# EAGLE design STM32F446RC_single layer (EAGLE 9.2.0)
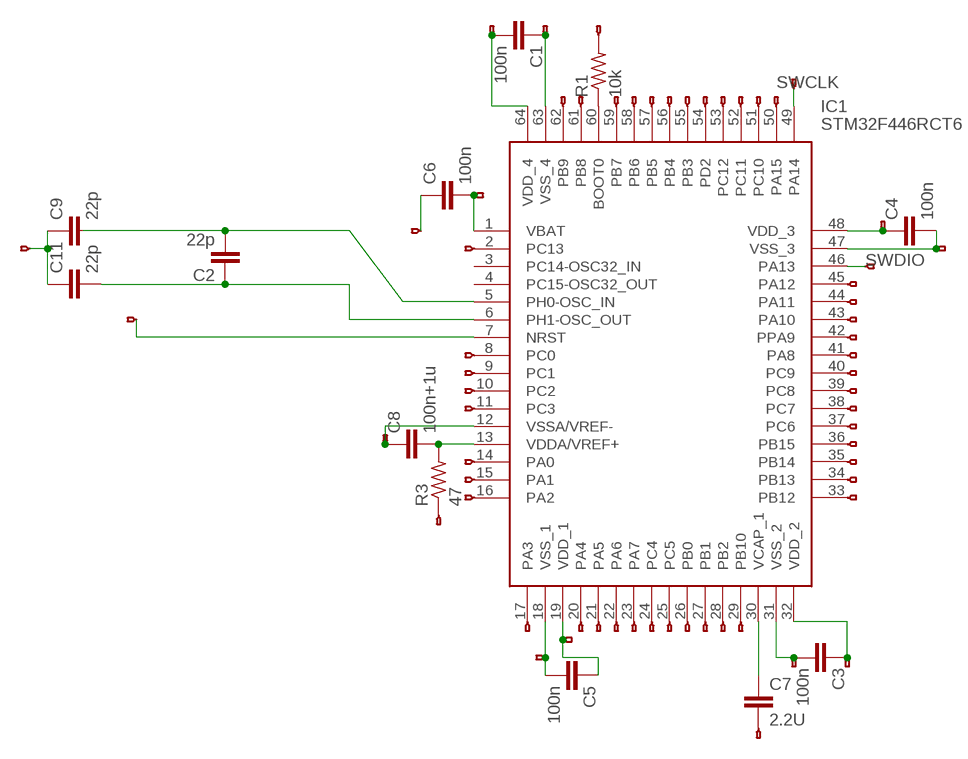
[diagram p0: schematic, sheet 1]

## Parts
C1  100n  C2,5-3  [C2.5-3]
C2  22p  C2,5-3  [C2.5-3]
C3  100n  C2,5-3  [C2.5-3]
C4  100n  C2,5-3  [C2.5-3]
C5  100n  C2,5-3  [C2.5-3]
C6  100n  C2,5-3  [C2.5-3]
C7  2.2U  C2,5-3  [C2.5-3]
C8  100n+1u  C2,5-3  [C2.5-3]
C9  22p  C2,5-3  [C2.5-3]
C11  22p  C2,5-3  [C2.5-3]
IC1  STM32F446RCT6  [QFP50P1200X1200X160-64N]
JP1  HEADERHOLE-HEADERHOLE  [1X1-HEADER-HOLE]
JP2  HEADERHOLE-HEADERHOLE  [1X1-HEADER-HOLE]
JP3  HEADERHOLE-HEADERHOLE  [1X1-HEADER-HOLE]
JP4  HEADERHOLE-HEADERHOLE  [1X1-HEADER-HOLE]
JP5  HEADERHOLE-HEADERHOLE  [1X1-HEADER-HOLE]
JP6  HEADERHOLE-HEADERHOLE  [1X1-HEADER-HOLE]
JP7  HEADERHOLE-HEADERHOLE  [1X1-HEADER-HOLE]
JP9  HEADERHOLE-HEADERHOLE  [1X1-HEADER-HOLE]
JP10  HEADERHOLE-HEADERHOLE  [1X1-HEADER-HOLE]
JP11  HEADERHOLE-HEADERHOLE  [1X1-HEADER-HOLE]
JP12  HEADERHOLE-HEADERHOLE  [1X1-HEADER-HOLE]
JP13  HEADERHOLE-HEADERHOLE  [1X1-HEADER-HOLE]
JP14  HEADERHOLE-HEADERHOLE  [1X1-HEADER-HOLE]
JP15  HEADERHOLE-HEADERHOLE  [1X1-HEADER-HOLE]
JP16  HEADERHOLE-HEADERHOLE  [1X1-HEADER-HOLE]
JP17  HEADERHOLE-HEADERHOLE  [1X1-HEADER-HOLE]
JP18  HEADERHOLE-HEADERHOLE  [1X1-HEADER-HOLE]
JP19  HEADERHOLE-HEADERHOLE  [1X1-HEADER-HOLE]
JP20  HEADERHOLE-HEADERHOLE  [1X1-HEADER-HOLE]
JP21  HEADERHOLE-HEADERHOLE  [1X1-HEADER-HOLE]
JP22  HEADERHOLE-HEADERHOLE  [1X1-HEADER-HOLE]
JP23  HEADERHOLE-HEADERHOLE  [1X1-HEADER-HOLE]
JP24  HEADERHOLE-HEADERHOLE  [1X1-HEADER-HOLE]
JP25  HEADERHOLE-HEADERHOLE  [1X1-HEADER-HOLE]
JP26  HEADERHOLE-HEADERHOLE  [1X1-HEADER-HOLE]
JP27  HEADERHOLE-HEADERHOLE  [1X1-HEADER-HOLE]
JP28  HEADERHOLE-HEADERHOLE  [1X1-HEADER-HOLE]
JP29  HEADERHOLE-HEADERHOLE  [1X1-HEADER-HOLE]
JP30  HEADERHOLE-HEADERHOLE  [1X1-HEADER-HOLE]
JP31  HEADERHOLE-HEADERHOLE  [1X1-HEADER-HOLE]
JP32  HEADERHOLE-HEADERHOLE  [1X1-HEADER-HOLE]
JP33  HEADERHOLE-HEADERHOLE  [1X1-HEADER-HOLE]
JP34  HEADERHOLE-HEADERHOLE  [1X1-HEADER-HOLE]
JP35  HEADERHOLE-HEADERHOLE  [1X1-HEADER-HOLE]
JP36  HEADERHOLE-HEADERHOLE  [1X1-HEADER-HOLE]
JP37  HEADERHOLE-HEADERHOLE  [1X1-HEADER-HOLE]
JP38  HEADERHOLE-HEADERHOLE  [1X1-HEADER-HOLE]
JP39  HEADERHOLE-HEADERHOLE  [1X1-HEADER-HOLE]
JP40  HEADERHOLE-HEADERHOLE  [1X1-HEADER-HOLE]
JP41  HEADERHOLE-HEADERHOLE  [1X1-HEADER-HOLE]
JP42  HEADERHOLE-HEADERHOLE  [1X1-HEADER-HOLE]
JP43  HEADERHOLE-HEADERHOLE  [1X1-HEADER-HOLE]
JP44  HEADERHOLE-HEADERHOLE  [1X1-HEADER-HOLE]
JP45  HEADERHOLE-HEADERHOLE  [1X1-HEADER-HOLE]
JP46  HEADERHOLE-HEADERHOLE  [1X1-HEADER-HOLE]
JP47  HEADERHOLE-HEADERHOLE  [1X1-HEADER-HOLE]
JP48  HEADERHOLE-HEADERHOLE  [1X1-HEADER-HOLE]
JP49  HEADERHOLE-HEADERHOLE  [1X1-HEADER-HOLE]
JP50  HEADERHOLE-HEADERHOLE  [1X1-HEADER-HOLE]
JP51  HEADERHOLE-HEADERHOLE  [1X1-HEADER-HOLE]
JP52  HEADERHOLE-HEADERHOLE  [1X1-HEADER-HOLE]
JP53  HEADERHOLE-HEADERHOLE  [1X1-HEADER-HOLE]
JP54  HEADERHOLE-HEADERHOLE  [1X1-HEADER-HOLE]
JP55  HEADERHOLE-HEADERHOLE  [1X1-HEADER-HOLE]
JP56  HEADERHOLE-HEADERHOLE  [1X1-HEADER-HOLE]
JP57  HEADERHOLE-HEADERHOLE  [1X1-HEADER-HOLE]
JP58  HEADERHOLE-HEADERHOLE  [1X1-HEADER-HOLE]
JP59  HEADERHOLE-HEADERHOLE  [1X1-HEADER-HOLE]
JP61  HEADERHOLE-HEADERHOLE  [1X1-HEADER-HOLE]
JP62  HEADERHOLE-HEADERHOLE  [1X1-HEADER-HOLE]
JP63  HEADERHOLE-HEADERHOLE  [1X1-HEADER-HOLE]
JP65  HEADERHOLE-HEADERHOLE  [1X1-HEADER-HOLE]
R1  10k  R-US_0204/2V  [0204V]
R3  47  R-US_0204/2V  [0204V]

## Nets
N$1: C3.2 IC1.31(VSS_2) JP50.1
N$2: C8.2 IC1.13(VDDA/VREF+) R3.2
N$3: IC1.7(NRST) JP63.1
N$4: C5.2 IC1.18(VSS_1) JP20.1
N$5: IC1.60(BOOT0) R1.1
N$6: C1.2 IC1.64(VDD_4) JP58.1
N$7: C2.1 C11.2 IC1.6(PH1-OSC_OUT)
N$8: C1.1 IC1.63(VSS_4) JP57.1
N$9: IC1.59(PB7) JP43.1
N$10: IC1.58(PB6) JP42.1
N$11: IC1.24(PC4) JP12.1
N$12: IC1.25(PC5) JP23.1
N$13: IC1.26(PB0) JP22.1
N$14: IC1.27(PB1) JP17.1
N$15: IC1.28(PB2) JP16.1
N$16: IC1.29(PB10) JP14.1
N$17: IC1.23(PA7) JP11.1
N$18: IC1.22(PA6) JP9.1
N$19: IC1.21(PA5) JP19.1
N$20: IC1.17(PA3) JP24.1
N$21: IC1.33(PB12) JP18.1
N$22: IC1.34(PB13) JP13.1
N$23: IC1.35(PB14) JP6.1
N$24: IC1.36(PB15) JP10.1
N$25: IC1.37(PC6) JP1.1
N$26: IC1.16(PA2) JP36.1
N$27: IC1.15(PA1) JP35.1
N$28: IC1.14(PA0) JP34.1
N$29: IC1.11(PC3) JP4.1
N$30: IC1.10(PC2) JP3.1
N$31: IC1.9(PC1) JP27.1
N$32: IC1.8(PC0) JP29.1
N$33: IC1.2(PC13) JP26.1
N$34: IC1.38(PC7) JP15.1
N$35: IC1.39(PC8) JP2.1
N$36: IC1.40(PC9) JP30.1
N$37: IC1.41(PA8) JP28.1
N$38: IC1.42(PPA9) JP31.1
N$39: IC1.43(PA10) JP33.1
N$40: IC1.44(PA11) JP32.1
N$41: IC1.45(PA12) JP25.1
N$42: IC1.57(PB5) JP41.1
N$43: IC1.56(PB4) JP40.1
N$44: IC1.55(PB3) JP44.1
N$45: IC1.54(PD2) JP38.1
N$46: IC1.53(PC12) JP39.1
N$47: IC1.52(PC11) JP5.1
N$48: IC1.51(PC10) JP37.1
N$49: IC1.50(PA15) JP45.1
N$50: IC1.61(PB8) JP46.1
N$51: IC1.62(PB9) JP47.1
N$52: IC1.20(PA4) JP21.1
N$53: C2.2 IC1.5(PH0-OSC_IN)
N$54: C7.2 JP49.1
N$55: C3.1 IC1.32(VDD_2) JP51.1
N$56: C4.2 IC1.47(VSS_3) JP52.1
N$57: JP56.1 R1.2
N$58: C6.2 IC1.1(VBAT) JP7.1
N$59: C8.1 IC1.12(VSSA/VREF-) JP62.1
N$60: JP61.1 R3.1
N$63: C9.1 C11.1 JP65.1
N$64: C5.1 IC1.19(VDD_1) JP48.1
N$66: C7.1 IC1.30(VCAP_1)
N$67: C6.1 JP59.1
N$89: C4.1 IC1.48(VDD_3) JP53.1
SWCLK: IC1.49(PA14) JP55.1
SWDIO: IC1.46(PA13) JP54.1
Unconnected: C9.2 IC1.3(PC14-OSC32_IN) IC1.4(PC15-OSC32_OUT)

## Library data of the parts
C1-C9 C11 = capacitor-wima:C: CAPACITOR naming: grid - package width
IC1 = STM32F446RCT6:STM32F446RCT6: STMICROELECTRONICS - STM32F446RCT6 - MCU, 32BIT, CORTEX-M4, 180MHZ, LQFP-64 Source: Datasheet <https://componentsearchengine.com/Datasheets/1/STM32F446RCT6.pdf>; DESCRIPTION: STMICROELECTRONICS - STM32F446RCT6 - MCU, 32BIT, CORTEX-M4, 180MHZ, LQFP-64; HEIGHT: 1.6mm; MANUFACTURER_NAME: STMicroelectronics; MANUFACTURER_PART_NUMBER: STM32F446RCT6; MOUSER_PART_NUMBER: 511-STM32F446RCT6; MOUSER_PRICE-STOCK: https://www.mouser.com/Search/Refine.aspx?Keyword=511-STM32F446RCT6
JP1-JP7 JP9-JP59 JP61-JP63 JP65 = F405Pill:HEADERHOLE
R1 R3 = rcl:R-US_: RESISTOR, American symbol; SPICEPREFIX: R

## Board
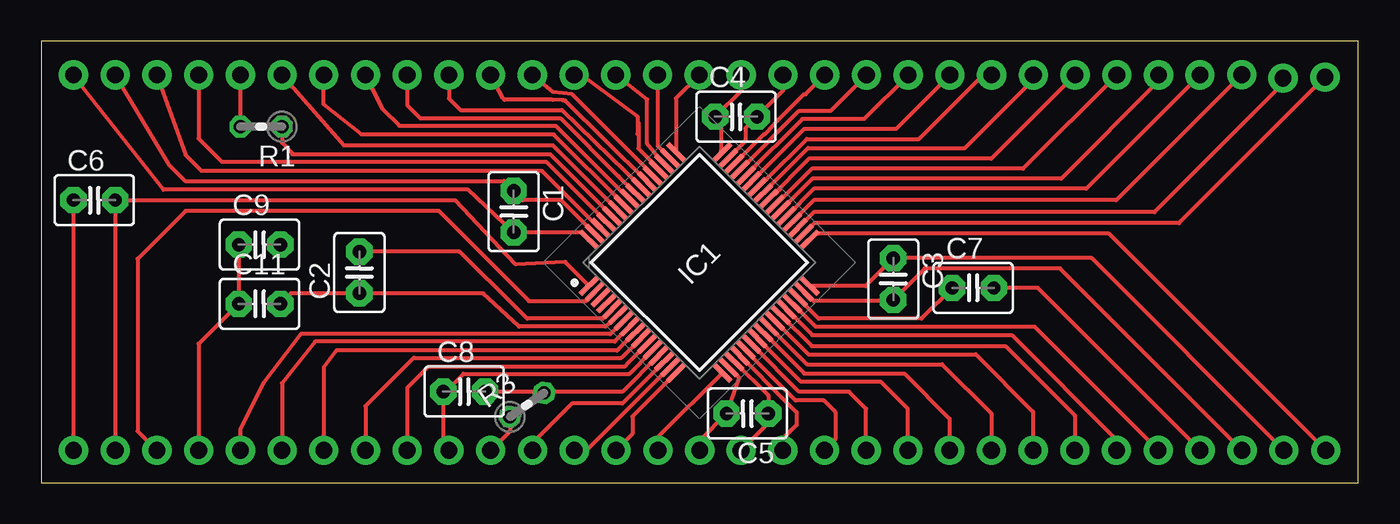
[diagram p1: board, top side]
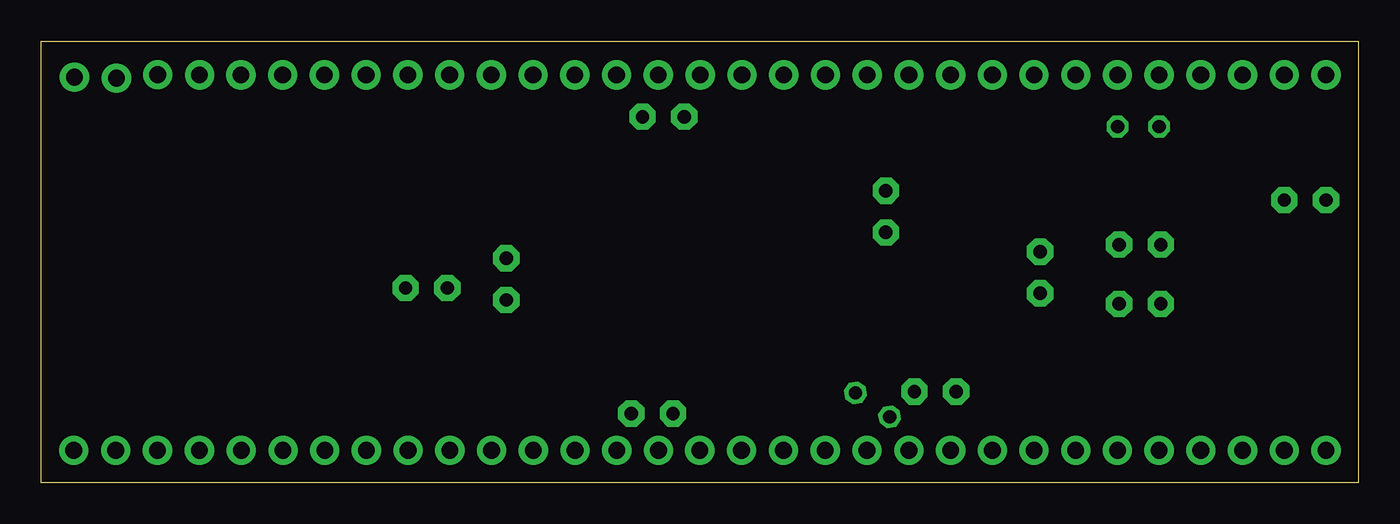
[diagram p2: board, bottom side, seen from below]

Size 80.2 x 26.9 mm. Coordinates in mm from the lower left corner, seen from the top.
Outline: 0,0 80.2,0 80.2,26.9 0,26.9 0,0
Copper layers (1*16): Top 0.035mm / dielectric 1.5mm / Bottom 0.035mm
Design rules "default": minimum track width 6mil, minimum drill 0.35mm, track to track 6mil, track to pad 6mil, pad to pad 6mil, via to via 6mil, smd to smd 6mil, copper to edge 40mil, drill to drill 6mil, minimum pad ring 10mil, minimum via ring 8mil, stop-mask expansion 4mil, vias tented up to drill 0mil, thermal gap 10mil

### Footprints (pad centres in the part's own frame; a part is rotated, then mirrored left to right if it is on the bottom)
C2.5-3 = drill 0.813 pad 1.6 octagon: 1 -1.27,0; 2 1.27,0
QFP50P1200X1200X160-64N = smd 1.475 x 0.3: 1 -5.738,3.75; 2 -5.738,3.25; 3 -5.738,2.75; 4 -5.738,2.25; 5 -5.738,1.75; 6 -5.738,1.25; 7 -5.738,0.75; 8 -5.738,0.25; 9 -5.738,-0.25; 10 -5.738,-0.75; 11 -5.738,-1.25; 12 -5.738,-1.75; 13 -5.738,-2.25; 14 -5.738,-2.75; 15 -5.738,-3.25; 16 -5.738,-3.75; 33 5.738,-3.75; 34 5.738,-3.25; 35 5.738,-2.75; 36 5.738,-2.25; 37 5.738,-1.75; 38 5.738,-1.25; 39 5.738,-0.75; 40 5.738,-0.25; 41 5.738,0.25; 42 5.738,0.75; 43 5.738,1.25; 44 5.738,1.75; 45 5.738,2.25; 46 5.738,2.75; 47 5.738,3.25; 48 5.738,3.75 | smd 0.3 x 1.475: 17 -3.75,-5.738; 18 -3.25,-5.738; 19 -2.75,-5.738; 20 -2.25,-5.738; 21 -1.75,-5.738; 22 -1.25,-5.738; 23 -0.75,-5.738; 24 -0.25,-5.738; 25 0.25,-5.738; 26 0.75,-5.738; 27 1.25,-5.738; 28 1.75,-5.738; 29 2.25,-5.738; 30 2.75,-5.738; 31 3.25,-5.738; 32 3.75,-5.738; 49 3.75,5.738; 50 3.25,5.738; 51 2.75,5.738; 52 2.25,5.738; 53 1.75,5.738; 54 1.25,5.738; 55 0.75,5.738; 56 0.25,5.738; 57 -0.25,5.738; 58 -0.75,5.738; 59 -1.25,5.738; 60 -1.75,5.738; 61 -2.25,5.738; 62 -2.75,5.738; 63 -3.25,5.738; 64 -3.75,5.738
1X1-HEADER-HOLE = drill 1.016 pad 1.778: 1 0,0
0204V = drill 0.813 octagon: 1 -1.27,0; 2 1.27,0

### Placement (x,y rotation side)
C1  28.77,16.51 270 top
C2  19.38,12.8 90 top
C3  51.88,12.4 270 top
C4  42.31,22.29 0 top
C5  43,4.21 180 top
C6  3.24,17.21 0 top
C7  56.74,11.86 0 top
C8  25.76,5.55 0 top
C9  13.3,14.5 0 top
C11  13.3,10.89 0 top
IC1  40.07,13.4 45 top
JP1  70.55,24.83 0 top
JP2  65.49,24.83 0 top
JP3  19.75,1.97 0 top
JP4  22.29,1.97 0 top
JP5  32.45,24.83 0 top
JP6  75.61,24.64 0 top
JP7  4.51,1.97 0 top
JP9  50.23,1.97 0 top
JP10  73.1,24.85 0 top
JP11  52.77,1.97 0 top
JP12  55.31,1.97 0 top
JP13  78.16,24.7 0 top
JP14  68.01,1.97 0 top
JP15  68.03,24.83 0 top
JP16  65.47,1.97 0 top
JP17  62.93,1.97 0 top
JP18  78.21,1.97 0 top
JP19  47.69,1.97 0 top
JP20  40.1,1.97 0 top
JP21  45.15,1.97 0 top
JP22  60.39,1.97 0 top
JP23  57.85,1.97 0 top
JP24  37.56,1.97 0 top
JP25  50.25,24.83 0 top
JP26  7.05,1.97 0 top
JP27  17.21,1.97 0 top
JP28  60.41,24.83 0 top
JP29  14.67,1.97 0 top
JP30  62.95,24.83 0 top
JP31  57.87,24.83 0 top
JP32  52.79,24.83 0 top
JP33  55.33,24.83 0 top
JP34  29.92,1.97 0 top
JP35  32.46,1.97 0 top
JP36  35,1.97 0 top
JP37  34.99,24.83 0 top
JP38  27.37,24.83 0 top
JP39  29.91,24.83 0 top
JP40  22.29,24.83 0 top
JP41  19.75,24.83 0 top
JP42  17.21,24.83 0 top
JP43  14.67,24.83 0 top
JP44  24.83,24.83 0 top
JP45  37.53,24.83 0 top
JP46  9.59,24.83 0 top
JP47  7.05,24.83 0 top
JP48  42.61,1.97 0 top
JP49  70.56,1.97 0 top
JP50  73.11,1.97 0 top
JP51  75.66,1.97 0 top
JP52  45.17,24.83 0 top
JP53  42.63,24.83 0 top
JP54  47.71,24.83 0 top
JP55  40.07,24.83 90 top
JP56  12.13,24.83 0 top
JP57  4.51,24.83 0 top
JP58  1.97,24.83 0 top
JP59  1.97,1.97 0 top
JP61  27.37,1.97 0 top
JP62  24.83,1.97 0 top
JP63  12.13,1.97 0 top
JP65  9.59,1.97 0 top
R1  13.4,21.69 180 top
R3  29.58,4.74 35 top

### Tracks (layer width: path | path; a pad name or v marks a point on that pad's centre or on a via)
N$1
  Top 0.152: 47.03,11.06 46.57,11.52 IC1.31 | 51.93,11.13 C3.2
  Top 0.254: JP50.1 62.03,13.05 53.8,13.05 C3.2 51.81,11.06 47.03,11.06
N$2
  Top 0.152: 37.58,7.71 IC1.13
  Top 0.254: IC1.13 35.39,5.54 30.69,5.54 R3.2 30.54,5.55 C8.2 27.24,5.34
N$3
  Top 0.152: 35.45,9.84 IC1.7
  Top 0.254: JP63.1 12.13,3.24 13.56,6.1 15.81,9.05 34.66,9.05 IC1.7
N$4
  Top 0.254: IC1.18 41.85,7.04 42.49,6.41 C5.2 40.1,2.58 JP20.1
N$5
  Top 0.152: 34.69,16.25 IC1.60
  Top 0.254: R1.1 14.67,20.7 15.3,20.07 15.3,20 31,20 IC1.60
N$6
  Top 0.152: 33.31,14.72 IC1.64 | 28.77,15.29 C1.2
  Top 0.254: JP58.1 7.45,17.85 26,17.85 C1.2 32.88,15.24 32.94,15.23 IC1.64
  Bottom 0.152: 2.07,24.73 JP58.1 | 28.77,15.29 C1.2
N$7
  Top 0.152: 14.62,10.99 C11.2
  Top 0.254: C11.2 15.21,11.53 C2.1 26.91,11.53 29.09,9.5 34.36,9.5 34.96,10.01 IC1.6
N$8
  Top 0.152: 33.62,15.18 IC1.63 | 28.77,17.73 C1.1 28.77,17.88
  Top 0.254: IC1.63 31.66,17.21 29.34,17.21 C1.1 28.17,18.38 8.77,18.38 7.8,19.34 JP57.1
N$9
  Top 0.152: 34.99,16.7 IC1.59
  Top 0.254: JP43.1 18.45,20.54 31.16,20.54 IC1.59
N$10
  Top 0.152: 35.45,17.01 IC1.58
  Top 0.254: JP42.1 17.21,23.03 19.51,21.2 31.21,21.2 IC1.58
N$11
  Top 0.254: IC1.24 46.47,6.65 52.55,6.65 55.31,3.89 JP12.1
N$12
  Top 0.254: IC1.25 46.64,7.21 54.85,7.21 57.85,4.21 JP23.1
N$13
  Top 0.254: IC1.26 46.72,7.81 56.9,7.81 60.39,4.32 JP22.1
N$14
  Top 0.152: 45.05,10.15 IC1.27
  Top 0.254: IC1.27 46.92,8.32 58.7,8.32 62.93,4.09 JP17.1
N$15
  Top 0.152: 45.51,10.45 IC1.28
  Top 0.254: IC1.28 46.96,8.98 59.1,8.98 65.47,2.61 JP16.1
N$16
  Top 0.152: 45.81,10.91 IC1.29
  Top 0.254: IC1.29 47.16,9.49 60.49,9.49 JP14.1
N$17
  Top 0.152: 43.68,8.78 IC1.23
  Top 0.254: IC1.23 46.27,6.14 51.13,6.14 52.77,4.5 JP11.1
N$18
  Top 0.152: 43.37,8.32 IC1.22
  Top 0.254: 43.37,8.32 46.16,5.54 49.19,5.54 50.23,4.5 JP9.1
N$19
  Top 0.152: IC1.21 42.91,8.02
  Top 0.254: JP19.1 48.35,2.63 48.35,4.3 47.65,5 45.93,5 42.91,8.02
N$20
  Top 0.152: 41.39,6.64 IC1.17
  Top 0.254: IC1.17 37.56,2.77 JP24.1
N$21
  Top 0.152: 47.31,15.17 IC1.33
  Top 0.254: JP18.1 65.01,15.17 47.31,15.17
N$22
  Top 0.152: IC1.34 46.59,15.32 46.59,15.34
  Top 0.254: IC1.34 47.08,15.81 69.27,15.81 JP13.1
N$23
  Top 0.152: 46.17,15.63 IC1.35
  Top 0.254: IC1.35 47.04,16.48 67.78,16.48 75.61,24.31 JP6.1
N$24
  Top 0.152: 45.81,15.94 IC1.36
  Top 0.254: IC1.36 47.05,17.2 65.45,17.2 JP10.1
N$25
  Top 0.152: 45.51,16.25 IC1.37
  Top 0.254: IC1.37 47.05,17.91 63.63,17.91 JP1.1
N$26
  Top 0.254: IC1.16 36,4.03 36,2.97 JP36.1
N$27
  Top 0.152: 38.19,6.95 IC1.15
  Top 0.254: 38.19,6.95 33.21,1.97 JP35.1
N$28
  Top 0.152: IC1.14 37.96,7.37 37.92,7.36
  Top 0.254: 37.92,7.36 35.39,4.82 32.32,4.82 29.92,2.42 JP34.1
N$29
  Top 0.254: IC1.11 35.76,7.32 35.51,7.05 23.57,7.05 22.29,5.77 JP4.1
N$30
  Top 0.152: 36.67,8.93 IC1.10
  Top 0.254: IC1.10 35.33,7.6 22.68,7.6 19.75,4.67 JP3.1
  Bottom 0.152: 19.75,2.07 JP3.1
N$31
  Top 0.152: 36.06,9.08 IC1.9
  Top 0.254: IC1.9 35.13,8.11 35.06,8.05 17.98,8.05 17.21,7.05 JP27.1
N$32
  Top 0.254: JP29.1 14.67,6.07 16.68,8.6 34.92,8.6 IC1.8
N$33
  Top 0.152: 33.62,11.52 IC1.2
  Top 0.254: 33.62,11.52 33.16,11.06 29.71,11.06 24.22,16.55 8.8,16.55 5.88,13.63 5.88,3.14 JP26.1
N$34
  Top 0.152: 45.05,16.7 IC1.38
  Top 0.254: IC1.38 46.95,18.51 62.1,18.51 68.03,24.44 JP15.1
N$35
  Top 0.152: 44.74,17.01 IC1.39
  Top 0.254: IC1.39 45.16,17.43 45.23,17.43 46.92,19.12 59.78,19.12 JP2.1
N$36
  Top 0.152: 44.68,17.55 44.44,17.31 IC1.40 44.75,17.75 44.81,17.69
  Top 0.254: 44.96,17.83 44.81,17.69 44.68,17.55 | IC1.40 46.75,19.73 57.84,19.73 JP30.1
N$37
  Top 0.152: 60.49,24.91 JP28.1
  Top 0.254: IC1.41 46.7,20.38 56.25,20.38 60.41,24.54 JP28.1
N$38
  Top 0.254: IC1.42 44.1,18.49 44.17,18.49 46.62,20.94 53.45,20.94 57.34,24.83 JP31.1
N$39
  Top 0.152: 43.22,18.23 IC1.43
  Top 0.254: IC1.43 46.45,21.54 52.04,21.54 JP33.1
  Bottom 0.152: JP33.1 55.33,24.78
N$40
  Top 0.254: 43.46,19.2 43.39,19.2 IC1.44 46.35,22.15 50.11,22.15 JP32.1
N$41
  Top 0.254: JP25.1 48.08,22.66 46.15,22.66 IC1.45
N$42
  Top 0.152: 35.75,17.31 IC1.57
  Top 0.254: JP41.1 20.77,22.79 21.82,21.74 31.32,21.74 35.75,17.31
N$43
  Top 0.152: 36.06,17.77 IC1.56
  Top 0.254: JP40.1 22.29,23 23.09,22.2 31.61,22.2 35.16,18.66 35.16,18.65 36.11,17.73 IC1.56
N$44
  Top 0.152: 36.51,18.07 IC1.55
  Top 0.254: JP44.1 24.83,23.4 25.53,22.7 31.71,22.7 IC1.55
N$45
  Top 0.152: 36.82,18.38 IC1.54 | 31.83,23.28 31.75,23.25 31.75,23.3
  Top 0.254: JP38.1 28.13,23.4 28.21,23.32 31.15,23.32 31.75,23.3 31.78,23.3 | IC1.54 31.9,23.28 31.83,23.28
N$46
  Top 0.152: 37.12,18.84 IC1.53
  Top 0.254: IC1.53 37.25,18.74 32.34,23.65 31.18,23.8 JP39.1
N$47
  Top 0.152: 37.58,19.14 IC1.52
  Top 0.254: 37.58,19.14 36.36,20.36 36.36,21.19 | 36.36,21.93 36.36,21.19 | JP5.1 32.9,24.83 36.31,22.3 36.31,21.24 36.36,21.19
N$48
  Top 0.152: 37.89,19.45 IC1.51
  Top 0.254: 37.89,19.45 36.9,20.66 36.9,23.33 JP37.1
N$49
  Top 0.254: JP45.1 37.53,20.54 IC1.50
N$50
  Top 0.152: 34.38,15.94 IC1.61
  Top 0.254: IC1.61 30.74,19.55 11,19.55 9.59,20.96 JP46.1
N$51
  Top 0.254: JP47.1 8.8,19.96 9.76,19 30.48,19 33.97,15.51 IC1.62
N$52
  Top 0.152: 42.61,7.71 IC1.20
  Top 0.254: IC1.20 45.29,4.99 45.99,4.29 45.99,3.51 45.15,2.67 JP21.1
N$53
  Top 0.152: 34.69,10.45 IC1.5
  Top 0.254: 18.95,14.5 C2.2 25.47,14.07 29,10.59 29.59,10 34.2,10 IC1.5
N$54
  Top 0.254: JP49.1 60.67,11.86 C7.2
  Bottom 0.152: JP49.1 70.51,2.07
N$55
  Top 0.152: 46.88,11.98 IC1.32
  Top 0.254: 46.88,11.98 50.19,11.98 C3.1 63.96,13.67 JP51.1
N$56
  Top 0.254: IC1.47 42.88,20.81 42.88,21.59 C4.2 45.17,23.88 JP52.1
N$57
  Top 0.254: JP56.1 R1.2
  Bottom 0.152: 12.23,24.78 JP56.1
N$58
  Top 0.152: 33.31,12.13 IC1.1
  Top 0.254: IC1.1 31.91,13.44 28.89,13.3 25.19,17.2 5.9,17.21 C6.2 JP7.1
N$59
  Top 0.152: 37.12,8.02 IC1.12 37.22,8.11
  Top 0.254: IC1.12 37.17,8.03 37.17,7.99 35.82,6.64 25.71,6.64 24.63,5.55 C8.1 24.49,2.31 JP62.1
N$60
  Top 0.254: R3.1 28.54,3.14 JP61.1
N$63
  Top 0.254: C9.1 C11.1 9.59,8.45 JP65.1
N$64
  Top 0.152: 42.3,7.25 IC1.19
  Top 0.254: IC1.19 44.27,5.31 C5.1 44.56,3.92 JP48.1
N$66
  Top 0.152: 46.12,11.22 IC1.30
  Top 0.254: 46.12,11.22 47.33,10 53.61,10 C7.1
N$67
  Top 0.254: C6.1 JP59.1
N$89
  Top 0.152: 41.39,20.21 IC1.48
  Top 0.254: JP53.1 42.63,23.88 C4.1 41.39,21.94 41.39,20.21
SWCLK
  Top 0.152: 38.65,20.21 IC1.49
  Top 0.254: 38.65,20.21 38.65,23.41 JP55.1
SWDIO
  Top 0.254: IC1.46 43.99,21.21 44.03,21.21 44.66,21.84 44.66,21.88 46.44,23.66 46.54,23.66 JP54.1